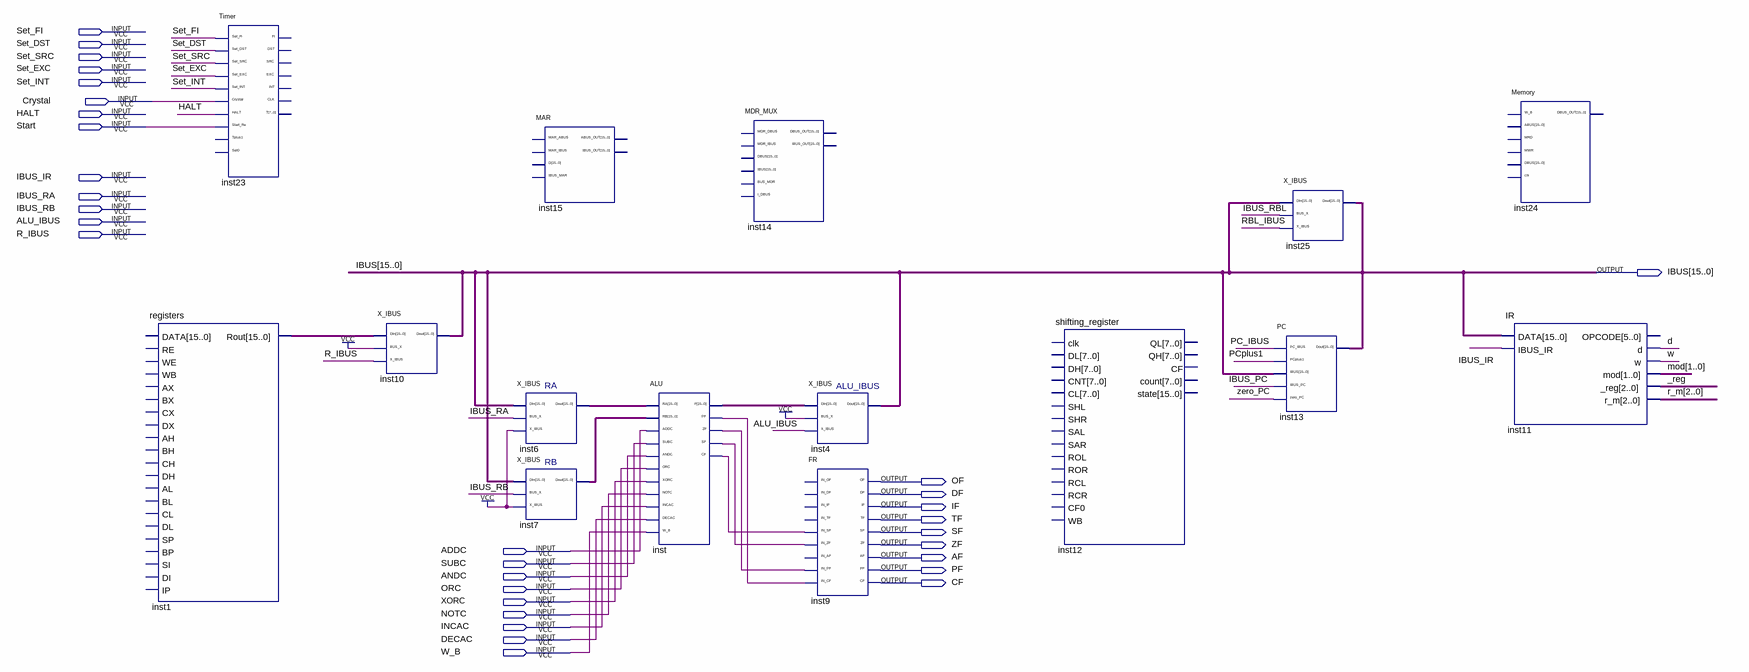
[diagram p0: schematic sheet]
// Quartus schematic CPU.bdf as structural Verilog: 15 symbols, 32 pins
module CPU (
  input  Set_FI,
  input  Set_DST,
  input  Set_SRC,
  input  Set_EXC,
  input  Set_INT,
  input  Crystal,
  input  HALT,
  input  Start,
  input  IBUS_IR,
  input  IBUS_RA,
  input  IBUS_RB,
  input  ALU_IBUS,
  input  R_IBUS,
  input  ADDC,
  input  SUBC,
  input  ANDC,
  input  ORC,
  input  XORC,
  input  NOTC,
  input  INCAC,
  input  DECAC,
  input  W_B,
  output [15:0] IBUS,
  output OF,
  output DF,
  output IF,
  output TF,
  output SF,
  output ZF,
  output AF,
  output PF,
  output CF
);

  wire _reg, d, IBUS_PC, IBUS_RBL, inst_cf, inst_pf, inst_sf, inst_zf, PC_IBUS, PCplus1, RBL_IBUS, w, zero_PC;
  wire [1:0] mod;
  wire [2:0] r_m;
  wire [15:0] inst1_rout, inst6_dout, inst7_dout, inst_f;

  registers inst1 (.Rout(inst1_rout));  // open: DATA, RE, WE, WB, AX, BX, CX, DX, AH, BH, CH, DH, AL, BL, CL, DL, SP, BP, SI, DI, IP
  Timer inst23 (
    .Set_Fi(Set_FI), .Set_DST(Set_DST), .Set_SRC(Set_SRC), .Set_EXC(Set_EXC), .Set_INT(Set_INT),
    .Crystal(Crystal), .HALT(HALT), .Start_Re(Start));  // open: Tplus1, Set0, FI, DST, SRC, EXC, INT, CLK, T
  X_IBUS inst10 (.DIn(inst1_rout), .BUS_X(1'b1), .X_IBUS(R_IBUS), .Dout(IBUS));
  MAR inst15 ();  // open: MAR_ABUS, MAR_IBUS, D, IBUS_MAR, ABUS_OUT, IBUS_OUT
  X_IBUS inst6 (.DIn(IBUS), .BUS_X(IBUS_RA), .X_IBUS(1'b1), .Dout(inst6_dout));
  X_IBUS inst7 (.DIn(IBUS), .BUS_X(IBUS_RB), .X_IBUS(1'b1), .Dout(inst7_dout));
  ALU inst (
    .RA(inst6_dout), .RB(inst7_dout), .ADDC(ADDC), .SUBC(SUBC), .ANDC(ANDC), .ORC(ORC), .XORC(XORC),
    .NOTC(NOTC), .INCAC(INCAC), .DECAC(DECAC), .W_B(W_B), .F(inst_f), .PF(inst_pf), .ZF(inst_zf),
    .SF(inst_sf), .CF(inst_cf));
  MDR_MUX inst14 ();  // open: MDR_DBUS, MDR_IBUS, DBUS, IBUS, BUS_MDR, I_DBUS, DBUS_OUT, IBUS_OUT
  X_IBUS inst4 (.DIn(inst_f), .BUS_X(1'b1), .X_IBUS(ALU_IBUS), .Dout(IBUS));
  FR inst9 (
    .IN_SF(inst_cf), .IN_ZF(inst_sf), .IN_PF(inst_zf), .IN_CF(inst_pf), .OF(OF), .DF(DF), .IF(IF), .TF(TF),
    .SF(SF), .ZF(ZF), .AF(AF), .PF(PF), .CF(CF));  // open: IN_OF, IN_DF, IN_IF, IN_TF, IN_AF
  shifting_register inst12 ();  // open: clk, DL, DH, CNT, CL, SHL, SHR, SAL, SAR, ROL, ROR, RCL, RCR, CF0, WB, QL, QH, CF, count, state
  X_IBUS inst25 (.DIn(IBUS), .BUS_X(IBUS_RBL), .X_IBUS(RBL_IBUS), .Dout(IBUS));
  PC inst13 (.PC_IBUS(PC_IBUS), .PCplus1(PCplus1), .IBUS(IBUS), .IBUS_PC(IBUS_PC), .zero_PC(zero_PC), .Dout(IBUS));
  Memory inst24 ();  // open: W_B, ABUS, MRD, MWR, DBUS, clk, DBUS_OUT
  IR inst11 (.DATA(IBUS), .IBUS_IR(IBUS_IR), .d(d), .w(w), .mod(mod), ._reg(_reg), .r_m(r_m));  // open: OPCODE
endmodule
